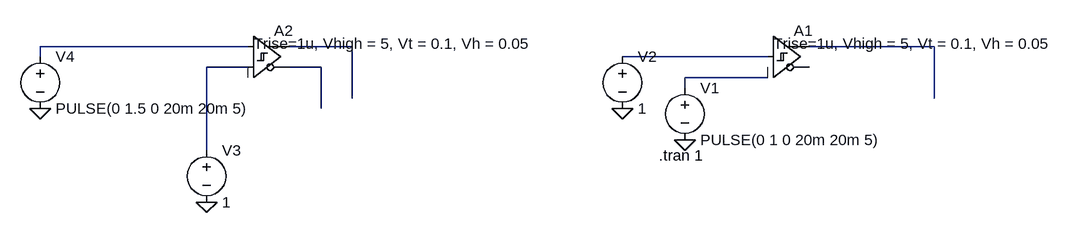
[diagram p0: schematic Schmitt Tigger Test.asc]
Schmitt Tigger Test.asc, the LTspice schematic file:
Version 4.1
SHEET 1 880 680
WIRE -624 128 -944 128
WIRE -464 128 -560 128
WIRE 432 128 240 128
WIRE -944 144 -944 128
WIRE 176 144 -48 144
WIRE -624 160 -688 160
WIRE -512 160 -560 160
WIRE 176 176 48 176
WIRE 48 192 48 176
WIRE -464 208 -464 128
WIRE 432 208 432 128
WIRE -512 224 -512 160
WIRE -688 288 -688 160
FLAG 48 272 0
FLAG -48 224 0
FLAG -688 368 0
FLAG -944 224 0
SYMBOL Digital\\schmitt 176 80 R0
WINDOW 3 8 44 Left 2
SYMATTR InstName A1
SYMATTR Value Trise=1u, Vhigh = 5, Vt = 0.1, Vh = 0.05
SYMBOL voltage 48 176 R0
WINDOW 123 0 0 Left 0
WINDOW 39 0 0 Left 0
SYMATTR InstName V1
SYMATTR Value PULSE(0 1 0 20m 20m 5)
SYMBOL voltage -48 128 R0
WINDOW 123 0 0 Left 0
WINDOW 39 0 0 Left 0
SYMATTR InstName V2
SYMATTR Value 1
SYMBOL Digital\\diffschmitt -624 80 R0
WINDOW 3 8 44 Left 2
SYMATTR InstName A2
SYMATTR Value Trise=1u, Vhigh = 5, Vt = 0.1, Vh = 0.05
SYMBOL voltage -688 272 R0
WINDOW 123 0 0 Left 0
WINDOW 39 0 0 Left 0
SYMATTR InstName V3
SYMATTR Value 1
SYMBOL voltage -944 128 R0
WINDOW 123 0 0 Left 0
WINDOW 39 0 0 Left 0
SYMATTR InstName V4
SYMATTR Value PULSE(0 1.5 0 20m 20m 5)
TEXT 8 296 Left 2 !.tran 1

The netlist it stands for:
* Schmitt Tigger Test.asc
A1 N004 N007 N007 N007 N007 N007 N003 N007 SCHMITT Trise=1u, Vhigh = 5, Vt = 0.1, Vh = 0.05
V1 N007 0 PULSE(0 1 0 20m 20m 5)
V2 N004 0 1
A2 N001 N005 0 0 0 N006 N002 0 SCHMITT Trise=1u, Vhigh = 5, Vt = 0.1, Vh = 0.05
V3 N005 0 1
V4 N001 0 PULSE(0 1.5 0 20m 20m 5)
.tran 1
.backanno
.end